# Altium project ENG-LINK.PrjPcb
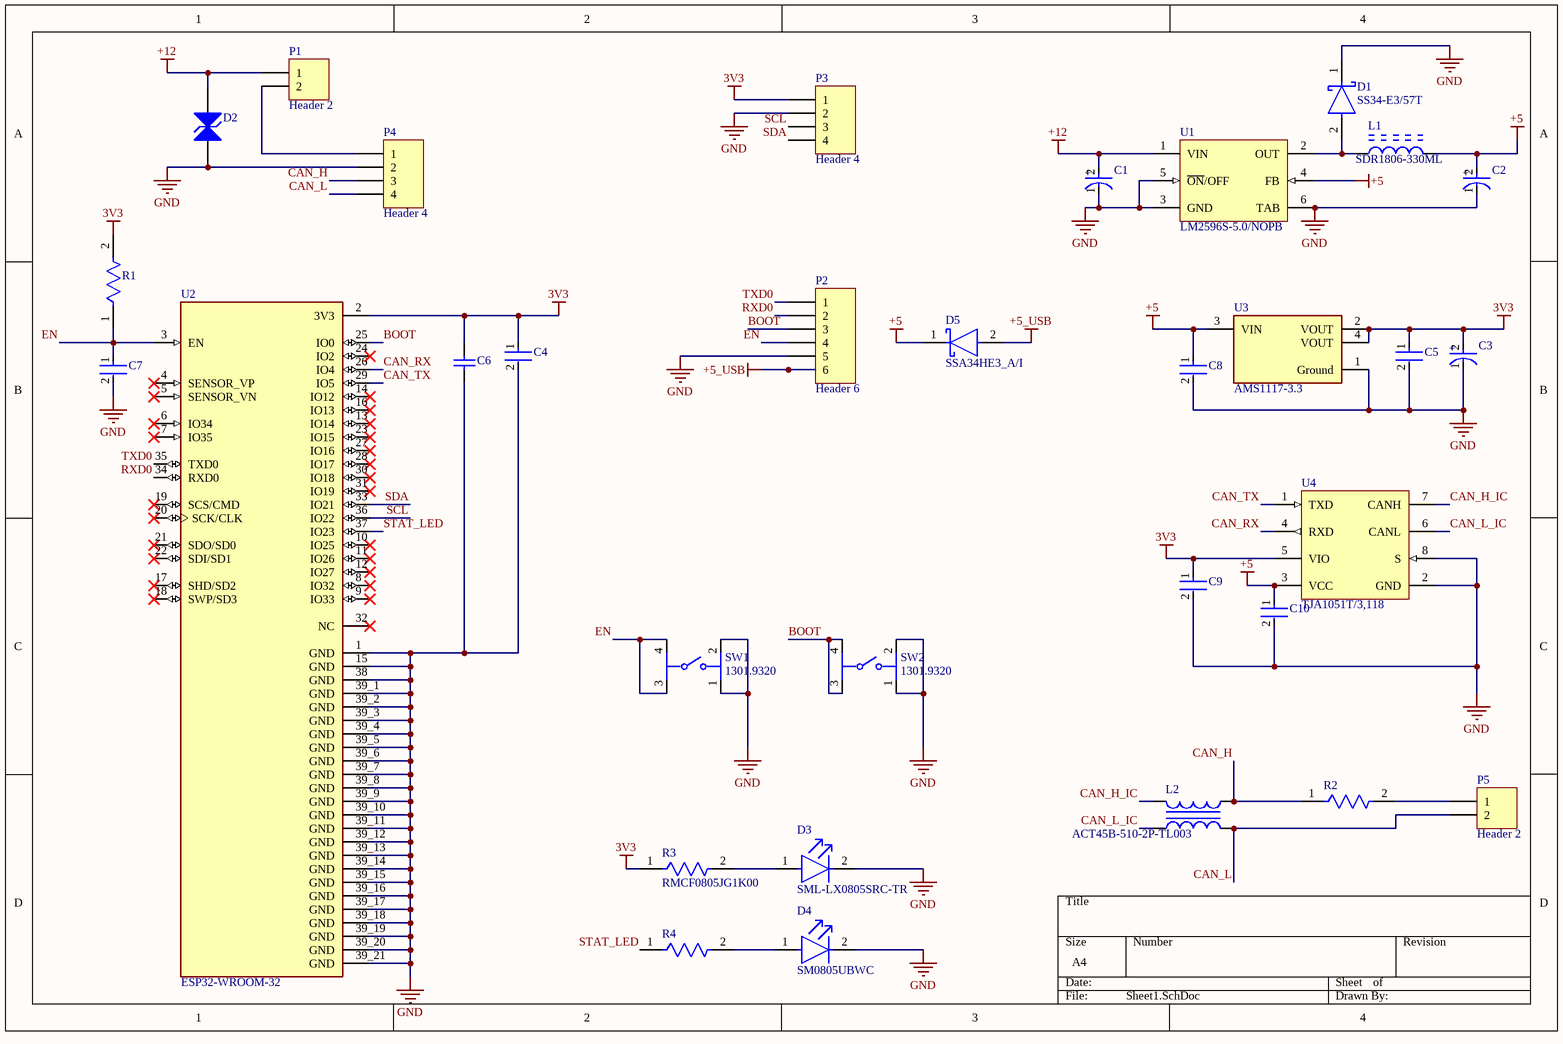
[diagram p0: Sheet1.SchDoc]
1 sheet, 32 parts. Net scope: global (net labels, ports and power ports of the same name join across sheets).
Board file: PCB2.PcbDoc

## Sheet Sheet1.SchDoc
size A4; SheetNumber: 1; SheetTotal: 1

### Parts
C1  EEE-TQV101XAP  [FP-TQD8-MFG]  (value not drawn)
C2  EEE-TQV101XAP  [FP-TQD8-MFG]  (value not drawn)
C3  EEE-TQV101XAP  [FP-TQD8-MFG]  (value not drawn)
C4  GRM21BZ71C106KE15L  [FP-GRM21B-0_2-e0_2_0_7-IPC_C]  (value not drawn)
C5  GRM21BZ71C106KE15L  [FP-GRM21B-0_2-e0_2_0_7-IPC_C]  (value not drawn)
C6  C0805S104K5RACTU  [CAPC2013X145X50NL20T25]  (value not drawn)
C7  GRM21BZ71C106KE15L  [FP-GRM21B-0_2-e0_2_0_7-IPC_C]  (value not drawn)
C8  GRM21BZ71C106KE15L  [FP-GRM21B-0_2-e0_2_0_7-IPC_C]  (value not drawn)
C9  GRM21BZ71C106KE15L  [FP-GRM21B-0_2-e0_2_0_7-IPC_C]  (value not drawn)
C10  GRM21BZ71C106KE15L  [FP-GRM21B-0_2-e0_2_0_7-IPC_C]  (value not drawn)
D1  SS34-E3/57T  [FP-95402-MFG]
D2  SMAJ15CA-E3/5A  [VISH-DO-214AC-2_M]  (value not drawn)
D3  SML-LX0805SRC-TR  [FP-SML-LX0805SRC-TR-MFG]
D4  SM0805UBWC  [FP-SM0805UBWC-MFG]
D5  SSA34HE3_A/I  [FP-95400-MFG]
L1  SDR1806-330ML  [BOUR-SDR1806_V]
L2  ACT45B-510-2P-TL003  [TDK-ACT45B-510-2P-TL003-4_V]
P1  Header 2  [HDR1X2]
P2  Header 6  [HDR1X6]
P3  Header 4  [HDR1X4]
P4  Header 4  [HDR1X4]
P5  Header 2  [HDR1X2]
R1  CRGCQ0805J10K  [FP-CRGCQ0805-IPC_C]  (value not drawn)
R2  AC0805FR-07120RL  [FP-AC0805-MFG]  (value not drawn)
R3  RMCF0805JG1K00  [FP-RMCF0805-IPC_B]
R4  AC0805FR-07120RL  [FP-AC0805-MFG]  (value not drawn)
SW1  1301.9320  [FP-1301_9320-MFG]
SW2  1301.9320  [FP-1301_9320-MFG]
U1  LM2596S-5.0/NOPB  [KTT0005B_M]
U2  ESP32-WROOM-32  [MODULE_ESP32-WROOM-32]
U3  AMS1117-3.3  [FP-AMS1117-IPC_C]
U4  TJA1051T/3,118  [NXP-SOIC-8_L]

### Nets
3V3: C3.2(A) C4.1 C5.1 C6.2 C9.1 P3.1 R1.2 R3.1 U2.2(3V3) U3.2(VOUT) U3.4(VOUT) U4.5(VIO)
+5: C2.2(A) C8.1 C10.1 D5.1(C) L1.2 U1.4(FB) U3.3(VIN) U4.3(VCC)
+5_USB: D5.2(A) P2.6
+12: C1.2(A) D2.2(A2) P1.1 U1.1(VIN)
GND: C1.1(C) C2.1(C) C3.1(C) C4.2 C5.2 C6.1 C7.2 C8.2 C9.2 C10.2 D1.1(C) D2.1(A1) D3.2(C) D4.2(C) P2.5 P3.2 P4.2 SW1.1 SW1.2 SW2.1 SW2.2 U1.3(GND) U1.5(~{ON}/OFF) U1.6(TAB) U2.1(GND) U2.15(GND) U2.38(GND) U2.39_1(GND) U2.39_2(GND) U2.39_3(GND) U2.39_4(GND) U2.39_5(GND) U2.39_6(GND) U2.39_7(GND) U2.39_8(GND) U2.39_9(GND) U2.39_10(GND) U2.39_11(GND) U2.39_12(GND) U2.39_13(GND) U2.39_14(GND) U2.39_15(GND) U2.39_16(GND) U2.39_17(GND) U2.39_18(GND) U2.39_19(GND) U2.39_20(GND) U2.39_21(GND) U3.1(Ground) U4.2(GND) U4.8(S)
BOOT: P2.3 SW2.3 SW2.4 U2.25(IO0)
CAN_H: L2.4 P4.3 R2.1
CAN_H_IC: L2.1 U4.7(CANH)
CAN_L: L2.3 P4.4 P5.2
CAN_L_IC: L2.2 U4.6(CANL)
CAN_RX: U2.26(IO4) U4.4(RXD)
CAN_TX: U2.29(IO5) U4.1(TXD)
EN: C7.1 P2.4 R1.1 SW1.3 SW1.4 U2.3(EN)
RXD0: P2.2 U2.34(RXD0)
SCL: P3.3 U2.36(IO22)
SDA: P3.4 U2.33(IO21)
STAT_LED: R4.1 U2.37(IO23)
TXD0: P2.1 U2.35(TXD0)
NetD1_2: D1.2(A) L1.1 U1.2(OUT)
NetD3_1: D3.1(A) R3.2
NetD4_1: D4.1(A) R4.2
NetP1_2: P1.2 P4.1
NetP5_1: P5.1 R2.2

Not connected (* = marked no-connect by the designer): U2 4(SENSOR_VP)* 5(SENSOR_VN)* 6(IO34)* 7(IO35)* 8(IO32)* 9(IO33)* 10(IO25)* 11(IO26)* 12(IO27)* 13(IO14)* 14(IO12)* 16(IO13)* 17(SHD/SD2)* 18(SWP/SD3)* 19(SCS/CMD)* 20(SCK/CLK)* 21(SDO/SD0)* 22(SDI/SD1)* 23(IO15)* 24(IO2)* 27(IO16)* 28(IO17)* 30(IO18)* 31(IO19)* 32(NC)*

### Notes on the sheet
- (in symbol CMP-05427-000054-1) +

### Library data of the parts
C1-C3 = CMP-05427-000054-1: CAP ALUM 100UF 20% 35V SMD; Ripple Current: 197mA; ESR (Equivalent Series Resistance): 300mR; Life (Hours): 2000Hour; Lead Diameter: 0.65mm; Diameter: 6.3mm; Termination: SMD/SMT; Package Quantity: 900; Min Operating Temperature: -40°C; Mount: Surface Mount; Series: TQ; Height: 7.7mm; Length: 7.7mm; Max Operating Temperature: 125°C; Voltage Rating (DC): 35V; Voltage: 35V; Construction: Cylindrical; Ripple Current (AC): 197mA; Capacitance: 100uF; Packaging: Tape and Reel; Lead Free: Lead Free; Height - Seated (Max): 0.315inch; Number of Pins: 8; Voltage Rating: 35V; Case/Package: Radial; Tolerance: 20%; REACH SVHC: No SVHC; Lead Pitch: 1.8mm; RoHS Compliant: Yes
C4 C5 C7-C10 = CMP-06035-007712-1: Chip Multilayer Ceramic Capacitors for General Purpose, 0805, 10uF, X7R, 15%, 10%, 16V
C6 = CMP-2007-01227-1: Manufacturer: Kemet; Part Number: C0805S104K5RACTU
D1 = CMP-02539-000012-1: DIODE SCHOTTKY 40V 3A DO214AB; Manufacturer: Vishay; Max Junction Temp: +150°C; Peak Reverse Current: 0.5mA; Max Surge Forward Current: 100A; Standoff Height: 0mm; ComponentLink2Description: Datasheet; Device Class L3: Schottky Diodes; Height: 2.62mm; Max Repetitive Reverse Voltage: 40V; Lead Free: Yes; Package: 95402; Temperature Range High: +150°C; ComponentLink2URL: http://www.vishay.com/docs/88751/ss32.pdf; Temperature: -55°C to +150°C; Footprint Url: http://www.vishay.com/docs/95402/smc.pdf; Automotive: No; Forward Current: 3A; Category: Diode; Manufacturer Part Number: SS34-E3/57T; RoHS: TRUE; Device Class L2: Diodes; Mouser Description: Schottky Diodes & Rectifiers 3.0 Amp 40 Volt; Octopart: https://octopart.com/ss34-e3%2F57t-vishay-39552907; Temperature Range Low: -55°C; Device Class L1: Discrete Semiconductors; Digikey Description: DIODE SCHOTTKY 40V 3A DO214AB
D2 = CMP-0548-00263-2: Transient Voltage Suppressor, 6.40 to 231 V, 15 V Stand-off Voltage, Bi-Directional, -55 to 155 degC, 2-pin DO-214AC, Pb-Free, Tape and Reel; Manufacturer: Vishay Semiconductor; VBR Bi-Directional (V): 6.4 to 231; ID (uA): 2; IFSM: 40 A; PPPM (W): 400, 300; VWM (V): 15; PackageDescription: 2-Pin DO-214AC (SMA), Body 4.245 x 2.665 mm; ComponentLink1URL: http://www.vishay.com/; ComponentLink2URL: http://www.vishay.com/docs/88390/smaj50a.pdf; Packing: Tape and Reel; Mounting Technology: Surface Mount; ComponentLink2Description: Datasheet; Operating Junction and Storage Temperature Range: -55 to 150 degC; PartNumber: SMAJ15CA-E3/5A; DatasheetVersion: 12/8/2013; RoHS: TRUE; PackageReference: DO-214AC-2; ComponentLink3URL: http://www.vishay.com/docs/88390/smaj50a.pdf; ComponentLink1Description: Manufacturer URL; ComponentLink3Description: Package Specification
D3 = CMP-57192-000013-1: LED RED CLEAR SMD; Forward Current: 20mA; Wavelength: 660nm; Forward Voltage: 1.7V; Luminous Intensity: 25mcd; Number of LEDs: 1; Current Rating: 25mA; Lens Color: Colorless; Power Rating: 100mW; Viewing Angle: 140°; Approvals: UL; Lens Transparency: Clear; Series: -; Package Quantity: 3000; Mount: Surface Mount; Lead Free: Lead Free; Case/Package: 0805; Max Operating Temperature: 85°C; Illumination Color: Red; Packaging: Tape and Reel; Length: 2mm; Lens Style: Clear; Width: 1.25mm; RoHS Compliant: Yes; Color: Red; Case Code (Metric): 2012; Dominant Wavelength: 660nm; Number of Pins: 2; Min Operating Temperature: -40°C; Case Code (Imperial): 0805; Voltage Rating (DC): 1.7V; Voltage Rating: 1.7V; Height: 1.2mm; Test Current: 20mA
D4 = CMP-35283-000004-1: LED BLUE CLEAR 0805 SMD; Dominant Wavelength: 470nm; Forward Voltage: 3.3V; Forward Current: 20mA; Lens Color: Colorless; Lens Style: Rectangular; Luminous Intensity: 115mcd; Viewing Angle: 130°; Power Rating: 100mW; Lens Transparency: Clear; Height: 1.1mm; Mount: Surface Mount; Packaging: Tape and Reel; Package Quantity: 3000; Illumination Color: Blue; Width: 1.2mm; Min Operating Temperature: -30°C; Case Code (Imperial): 0805; Length: 2mm; Test Current: 20mA; Max Operating Temperature: 80°C; Case Code (Metric): 2012; Color: Blue; Wavelength: 470nm; Case/Package: 0805; Lead Free: Lead Free; Number of Pins: 2
D5 = CMP-02539-000063-1: DIODE SCHOTTKY 40V 3A DO214AC; Forward Voltage: 380mV; Peak Non-Repetitive Surge Current: 75A; Element Configuration: Single; Max Reverse Current: 17mA; Radiation Hardening: No; Max Operating Temperature: 150°C; Min Operating Temperature: -65°C; Packaging: Tape and Reel; Case/Package: DO-214AC; Forward Current: 3A; Series: Automotive, AEC-Q101; Max Repetitive Reverse Voltage (Vrrm): 40V; Average Rectified Current: 3A; Mount: Surface Mount; Reverse Voltage (DC): 40V; Package Quantity: 7500; RoHS Compliant: Yes; Max Reverse Voltage (DC): 40V; Max Forward Surge Current (Ifsm): 75A
L1 = CMP-2000-07043-1: Power Inductor, 33 uH, +/- 20%, -40 to 125 degC, 2-Pin SMD, RoHS, Tape and Reel; Manufacturer: Bourns; Minimum Quality Factor: 24@2.52MHz; Product Height: 6.9mm; Core Material: Ferrite; Maximum DC Current: 3A; Maximum DC Resistance: 68mOhm; Product Depth: 14.3mm; Inductance: 33uH; Rad Hard: No; Packaging: Tape&Reel; Mounting Technology: SurfaceMount; Manufacturer URL: http://www.bourns.com/; Package Description: 2-Pin Surface Mount Device, Body 18.3 x 14 mm; Type: Power; Package Reference: SDR1806; Datasheet URL: http://www.bourns.com/docs/Product-Datasheets/SDR1806.pdf; Tolerance: 20%; Datasheet Version: 09/2010; Package/Case: 18.6X14.3X6.9
L2 = CMP-2000-05391-1: Common-Mode Choke for CAN Bus System, 51uH, 50 V DC, -40 to 150 degC, 4-Pin SMD, RoHS, Tape and Reel; Manufacturer: TDK; Number of Lines: 2; Impedance: 2.8kOhm; Current: 200mA; Featured Product: FerriteChipCommon-ModeFilterforCAN-BUSSystem; Inductance: 51µH; Other Names: 445-3958-6; Filter Type: Data,SignalLine; DC Resistance (DCR): 1OhmMax; Dynamic Catalog: ACTSeries; Other Drawings: ACM3225SeriesSchematic / ACT45B-xxx-2P_Footprint; Catalog Drawings: (ACM4532,ACT45B)-xxx-2P_Top / ACT45B-xxx-2P_Side / ACT45B-xxx-2P_Bottom; Package / Case: Horizontal,4PCPad; Family: CommonModeChokes; Datasheet Version: Aug-12; Height (Max): 0.118"(3.00mm); Packaging: Digi-Reel; Category: Filters; Datasheet URL: https://datasheet.ciiva.com/22726/1649098-22726290.pdf; Mounting Type: SurfaceMount; Operating Temperature: -40degC~150degC; Size / Dimension: 0.177"Lx0.126"W(4.50mmx3.20mm); Series: ACT; Manufacturer URL: http://www.tdk.com/; Standard Package: 1
P1 P5 = Header 2: Header, 2-Pin; LatestRevisionDate: 17-Jul-2002; LatestRevisionNote: Re-released for DXP Platform.; Publisher: Altium Limited
P2 = Header 6: Header, 6-Pin; LatestRevisionDate: 17-Jul-2002; LatestRevisionNote: Re-released for DXP Platform.; Publisher: Altium Limited
P3 P4 = Header 4: Header, 4-Pin; LatestRevisionDate: 17-Jul-2002; LatestRevisionNote: Re-released for DXP Platform.; Publisher: Altium Limited
R1 = CMP-03211-002989-1: CRGCQ 0805 10K 5%; Manufacturer: TE Connectivity; Voltage Rating: 150V; Temperature Coefficient: ±100ppm/°C; Resistance: 10KΩ; Value: 10KΩ; Power Rating: 0.125W; Tolerance: 0.05; Automotive Grade: Grade 914; Height: 0.65mm; Lead Free: Yes; Temperature Range High: +155°C; Composition: Thick Film; Temperature Range Low: -55°C; Ambient Temperature Range High: +70°C; Temperature: -55°C to +155°C; Package: CRGCQ0805; Device Class L2: Resistors; RoHS: TRUE; ComponentLink2URL: https://www.te.com/commerce/DocumentDelivery/DDEController?Action=showdoc&DocId=Data+Sheet%7F1773204-3%7F1%7Fpdf%7FEnglish%7FENG_DS_1773204-3_1.pdf%7F4-2176341-923; Manufacturer Part Number: CRGCQ0805J10K; Series: CRGCQ; Device Class L1: Passive Components; Ipc Land Pattern Name: RESC200125X55; ComponentLink2Description: Datasheet; Category: Res; Digikey Description: CRGCQ 0805 10K 5%; Mouser Description: Res Thick Film 0805 10K Ohm 5% 0.125W(1/8W) ±100ppm/C Pad SMD Automotive T/R; Automotive: Yes; Octopart: https://octopart.com/crgcq0805j10k-te+connectivity-91018201; Device Class L3: Chip SMD Resistors
R2 R4 = CMP-03412-037684-1: RES SMD 120 OHM 1% 1/8W 0805; Manufacturer: Yageo; Value: 120Ω; Voltage Rating: 150V; Automotive Grade: Grade 0; Tolerance: 0.01; Device Class L2: Resistors; Temperature Range Low: -55°C; Automotive: Yes; Package: AC0805; Height: 0.6mm; Power Rating: 1/8W; ComponentLink2URL: http://www.yageo.com/documents/recent/PYu-AC_51_RoHS_L_6.pdf; ComponentLink2Description: Datasheet; Composition: Thick Film; Device Class L1: Passive Components; Lead Free: Yes; Mouser Description: Res Thick Film 0805 120 Ohm 1% 0.125W(1/8W) ±100ppm/C Epoxy Pad SMD Automotive T/R; Octopart: https://octopart.com/ac0805fr-07120rl-yageo-30510890; Device Class L3: Chip SMD Resistors; Ipc Land Pattern Name: RESC200125X50; Footprint Url: http://www.yageo.com/exep/pages/download/literatures/PYu-R_Mount_10.pdf; Temperature: -55°C to +155°C; Category: Res; Temperature Range High: +155°C; Manufacturer Part Number: AC0805FR-07120RL; RoHS: TRUE; Series: AC; Resistance: 120Ω; Digikey Description: RES SMD 120 OHM 1% 1/8W 0805
R3 = CMP-26527-002856-1: 1kΩ ±5% 0.125W 0805 Thick Film Chip Resistor AEC-Q200 compliant; Max Power Dissipation: 125mW; Temperature Coefficient: 200ppm/°C; Resistance: 1kR; Width: 0.049inch; Resistor Type: Thick Film; Length: 0.079inch; Case Code (Imperial): 0805; Radiation Hardening: No; Mount: Surface Mount; Max Operating Temperature: 155°C; Min Operating Temperature: -55°C; Features: Automotive AEC-Q200; Contact Plating: Tin; Case/Package: 0805; Height: 0.026inch; Number of Terminations: 2; Packaging: Tape and Reel; Series: RMCF; Case Code (Metric): 2012; RoHS Compliant: Yes; Tolerance: 5%
SW1 SW2 = CMP-26321-000001-1: SWITCH TACTILE SPST-NO 0.05A 12V; Manufacturer: Schurter; Electromechanical Life: 100000Cycles; Contact Current Rating: 50mA; Contact Resistance: 100mΩ; Operating Force: 1.6N; Height: 12.5mm; ComponentLink2Description: Datasheet; Temperature Range Low: -20°C; Device Class L1: Electromechanical; Voltage Rating Dc: 12V; Device Class L3: Tactile Switches; Throw Configuration: SPST-NO; ComponentLink2URL: https://www.schurter.com/en/datasheet/typ_6x6_mm_tact_switches.pdf; Lead Free: Yes; Temperature: -20°C to +70°C; Manufacturer Part Number: 1301.9320; Mount: Surface Mount; Digikey Description: SWITCH TACTILE SPST-NO 0.05A 12V; Device Class L2: Switches; Temperature Range High: +70°C; Category: Switch; RoHS: TRUE; Automotive: No; Octopart: https://octopart.com/1301.9320-schurter-6627962; Package: 0
U1 = CMP-0069-00269-3: SIMPLE SWITCHER® Power Converter 150 KHz 3A Step-Down Voltage Regulator, 5-pin TO-263, Pb-Free; Manufacturer: Texas Instruments; PowerWise: N; PackageTopMarking: NSUZXYTTE#*LM2596S*-5.0 P+; ComponentLink1URL: http://www.ti.com/general/docs/lit/getliterature.tsp?genericPartNumber=LM2596&fileType=pdf; PackageDescription: TO-263, Molded, .400 x .390 x .180in, 5 Lead, .067in Pitch, Surface Mount; RoHS: Y; PinCount: 5; Code_JEDEC: MO-169-AB; ComponentLink1Description: Datasheet URL; PackageReference: KTT0005B; CompType: Switcher
U2 = ESP32-WROOM-32: Bluetooth, WiFi 802.11b/g/n, Bluetooth v4.2 +EDR, Class 1, 2 and 3 Transceiver Module 2.4GHz ~ 2.5GHz Antenna Not Included, U.FL Surface Mount; MF: Espressif Systems; Price: None; Availability: In Stock; MP: ESP32-WROOM-32; Package: Module Espressif Systems; SnapEDA_Link: https://www.snapeda.com/parts/ESP32-WROOM-32/Espressif+Systems/view-part/?ref=snap; Check_prices: https://www.snapeda.com/parts/ESP32-WROOM-32/Espressif+Systems/view-part/?ref=eda; Value: *; Purchase-URL: https://pricing.snapeda.com/search/part/ESP32-WROOM-32/?ref=eda
U3 = CMP-209535-000001-1: LDO Voltage Regulators 1A, 3.3V; Manufacturer: Advanced Monolithic Systems; Dropout Voltage: 1.1V; Output Type: Fixed; Nominal Supply Current: 5mA; Max Power Dissipation: 1.2W; Max Supply Voltage: 15V; Number Of Outputs: 1; Standoff Height: 0.64mm; Max Junction Temp: +125°C; Height: 1.8mm; Package: AMS1117; Device Class L2: Power Management ICs; ComponentLink2Description: Datasheet; ComponentLink2URL: http://www.advanced-monolithic.com/pdf/ds1117.pdf; Category: IC; RoHS: TRUE; Automotive: No; Device Class L1: Integrated Circuits (ICs); Output Current: 1A; Device Class L3: Voltage Regulators - Linear; Temperature: -40°C to +125°C; Output Voltage: 3.3V; Manufacturer Part Number: AMS1117-3.3; Temperature Range Low: -40°C; Octopart: https://octopart.com/ams1117-3.3-advanced+monolithic+systems-25899300; Lead Free: Yes; Ipc Land Pattern Name: SOT229P700X180-4; Temperature Range High: +125°C
U4 = CMP-2000-07245-1: High-Speed CAN Transceiver, 3 to 5 V, 8-Pin SOIC (SOT96-1), RoHS, Tape and Reel; Manufacturer: NXP; Power Down Mode: Normal/Silent; Rad Hardened: No; Number of Transceivers: 1; Supply Current: 70mA; Operating Supply Voltage (Max): 5.5V; Operating Supply Voltage (Typ): 5V; Operating Supply Voltage (Min): 4.5V; Standard Supported: ISO11898-2; Data Rate: 1Mbps; DELETED: Compliant; Operating Temperature (Min): -40C; Datasheet Version: Rev. 7, 01/2015; Pin Count: 8; Operating Temperature (Max): 125C; Package Description: 8-Pin Small Outline Integrated Circuit, Body 4.9 x 3.9 mm, Pitch 1.27 mm; Category: Transceiver; Packaging: TapeandReel; Mounting: SurfaceMount; Package Reference: SOT96-1; Operating Temperature Classification: Automotive; Mounting Technology: SurfaceMount; Package Type: SO; Manufacturer URL: http://www.nxp.com/; Datasheet URL: http://www.nxp.com/documents/data_sheet/TJA1051.pdf